# EAGLE schematic ai_gpiolabel_rpi (EAGLE 7.1.0)
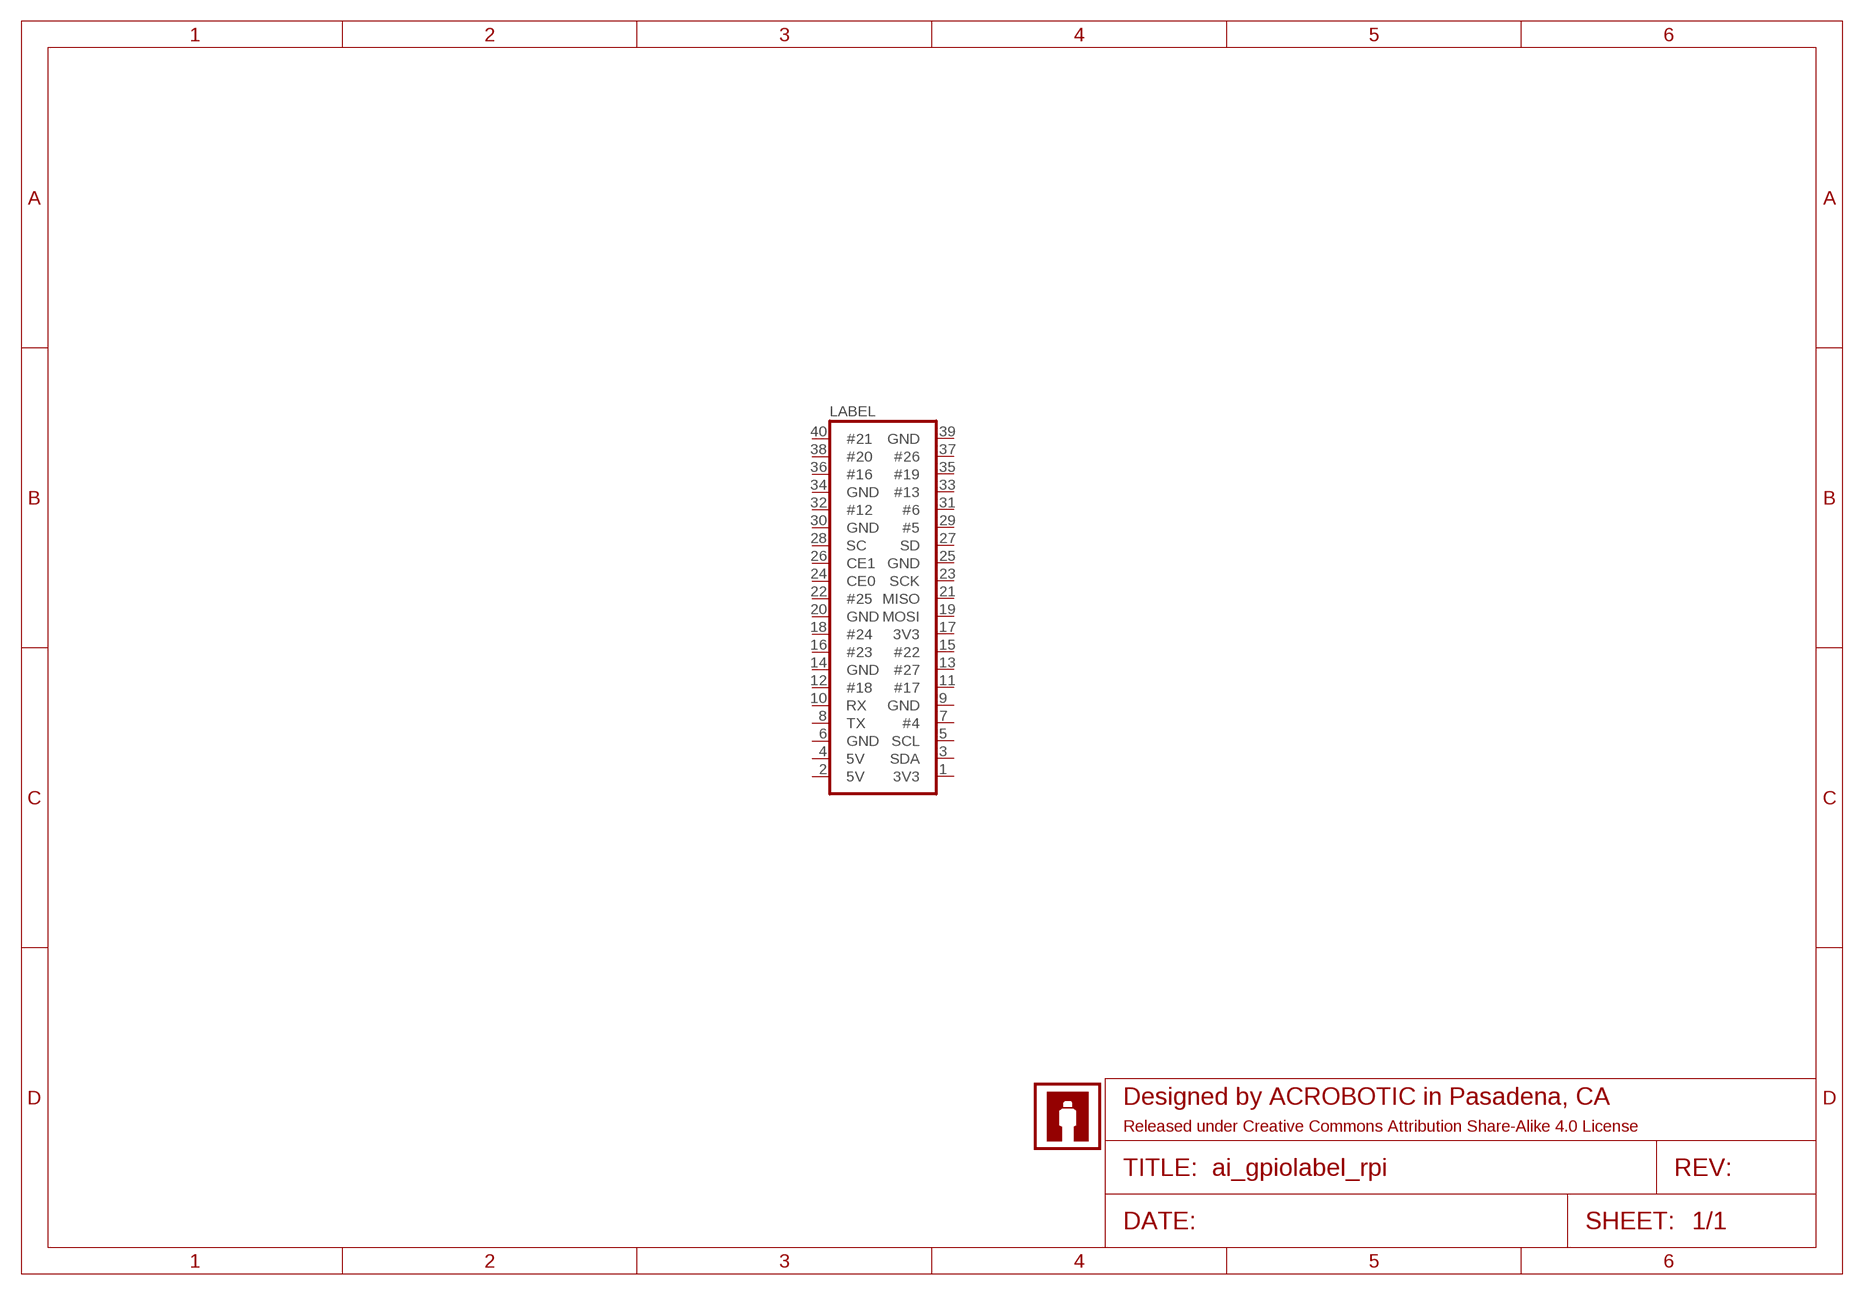
[diagram p0: schematic, sheet 1]

## Parts
FRAME1  FRAME-LETTER  [CREATIVE-COMMONS]
LABEL  2X20-RPI-NOFIRST  [2X20-RPI-NOFIRST]
U$2  AI-LOGOXS  [AI-LOGO-XS]
U$4  AI-LOGOXS  [AI-LOGO-XS]
Unconnected: LABEL.1(3V3) LABEL.2(5V) LABEL.3(SDA) LABEL.4(5V) LABEL.5(SCL) LABEL.6(GND) LABEL.7(#4) LABEL.8(TX) LABEL.9(GND) LABEL.10(RX) LABEL.11(#17) LABEL.12(#18) LABEL.13(#27) LABEL.14(GND) LABEL.15(#22) LABEL.16(#23) LABEL.17(3V3) LABEL.18(#24) LABEL.19(MOSI) LABEL.20(GND) LABEL.21(MISO) LABEL.22(#25) LABEL.23(SCK) LABEL.24(CE0) LABEL.25(GND) LABEL.26(CE1) LABEL.27(SD) LABEL.28(SC) LABEL.29(#5) LABEL.30(GND) LABEL.31(#6) LABEL.32(#12) LABEL.33(#13) LABEL.34(GND) LABEL.35(#19) LABEL.36(#16) LABEL.37(#26) LABEL.38(#20) LABEL.39(GND) LABEL.40(#21)

## Library data of the parts
FRAME1 = Ai_Miscellany:FRAME-LETTER: Schematic Frame A4 (8.5x11) US Letter frame based on the built-in A4-LOC frame.; REV: 1.0
LABEL = Ai_Connectors:2X20-RPI
U$2 U$4 = Ai_Miscellany:AI-LOGO